# EAGLE design Lyra_Main_Solo (EAGLE 9.6.0)
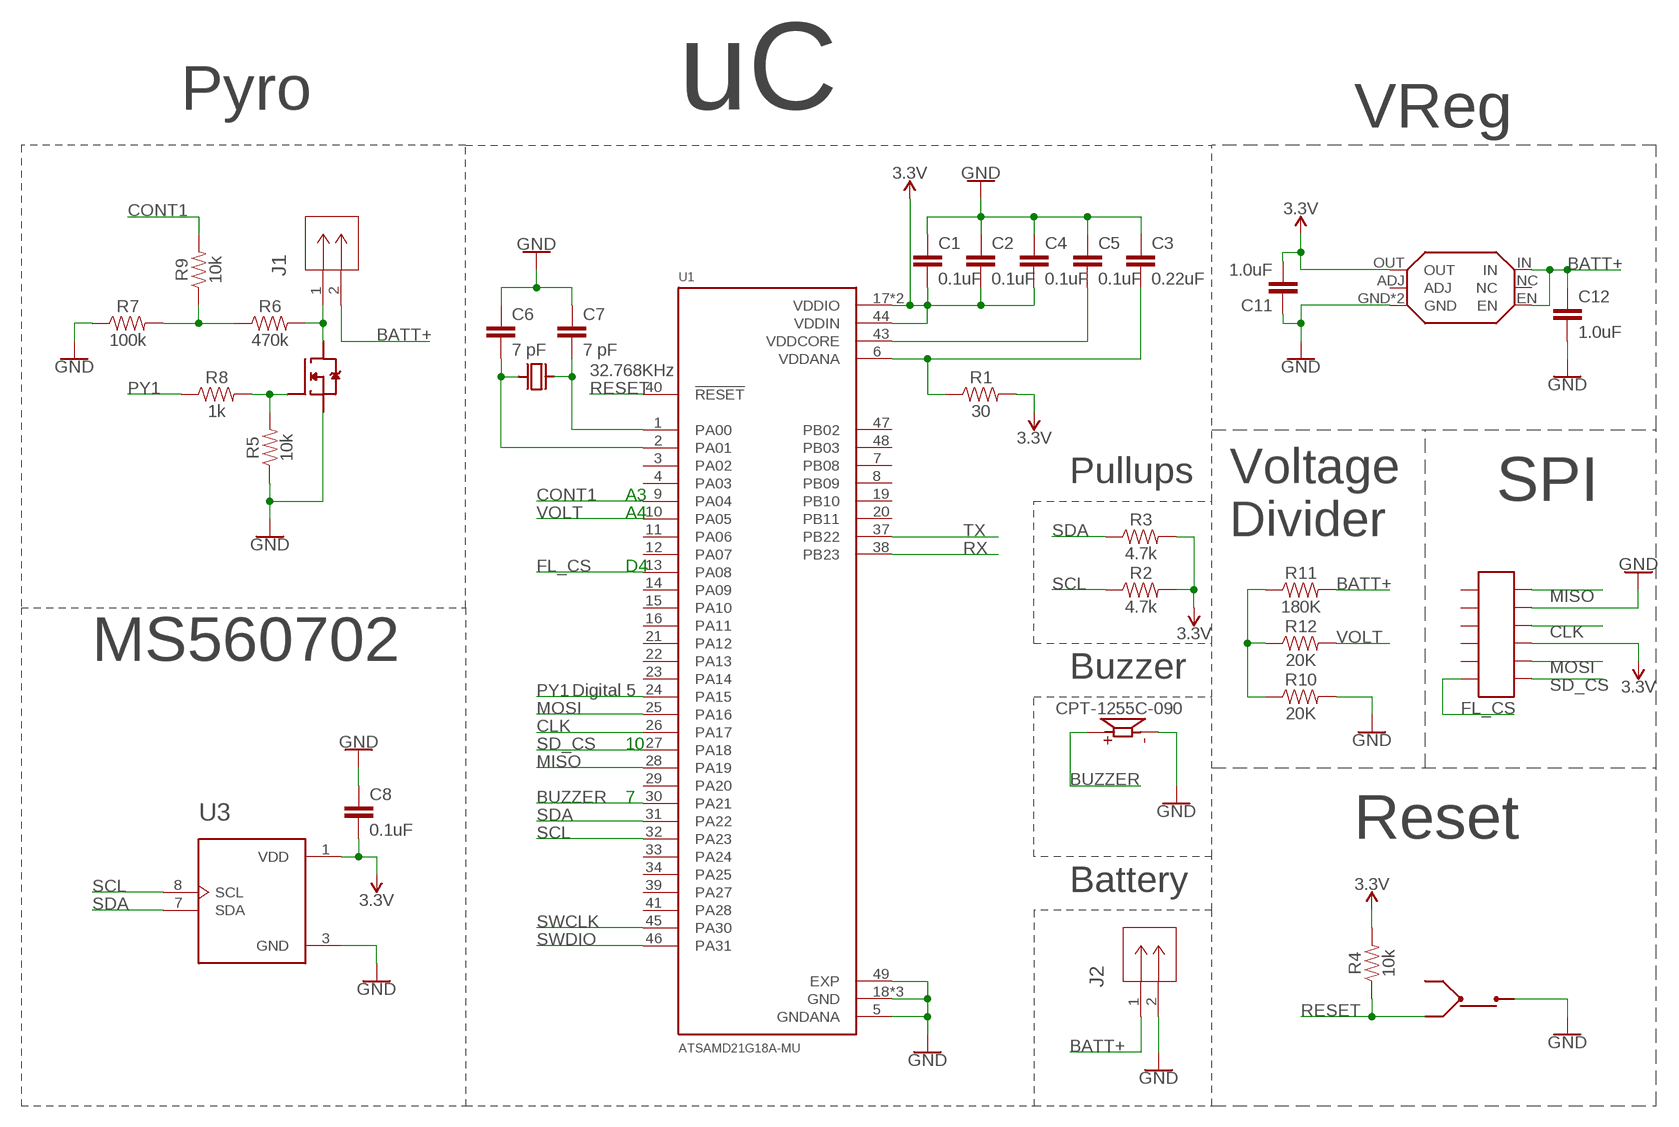
[diagram p0: schematic, sheet 1]

## Parts
C1  0.1uF  0.1UF-0603-25V-(+80/-20%)  [0603]
C2  0.1uF  0.1UF-0603-25V-(+80/-20%)  [0603]
C3  0.22uF  0.1UF-0603-25V-(+80/-20%)  [0603]
C4  0.1uF  0.1UF-0603-25V-(+80/-20%)  [0603]
C5  0.1uF  0.1UF-0603-25V-(+80/-20%)  [0603]
C6  7 pF  0.1UF-0402-16V-10%  [0402]
C7  7 pF  0.1UF-0402-16V-10%  [0402]
C8  0.1uF  0.1UF-0603-25V-(+80/-20%)  [0603]
C11  1.0uF  1.0UF-0402-16V-10%  [0402]
C12  1.0uF  1.0UF-0402-16V-10%  [0402]
J1  OSTVN02A150  [CONN_OSTVN02A150_OST]
J2  OSTVN02A150  [CONN_OSTVN02A150_OST]
LS2  CPT-1255C-090  [CUI_CPT-1255C-090]
R1  30  RESISTOR0402  [0402]
R2  4.7k  4.7KOHM-0603-1/10W-1%  [0603]
R3  4.7k  4.7KOHM-0603-1/10W-1%  [0603]
R4  10k  RESISTOR0402  [0402]
R5  10k  RESISTOR0402  [0402]
R6  470k  RESISTOR0402  [0402]
R7  100k  RESISTOR0402  [0402]
R8  1k  RESISTOR0402  [0402]
R9  10k  RESISTOR0402  [0402]
R10  20K  RESISTOR0402  [0402]
R11  180K  RESISTOR0402  [0402]
R12  20K  RESISTOR0402  [0402]
U1  ATSAMD21G18A-MU  [QFN50P700X700X90-49N]
U3  MS860702BA01-50  [TE_MS860702BA01-50]
U$1  32.768KHz  FC-135  [FC-135]
U$2  IRLHM630PBF  [IRLHM630PBF]
U$3  NCP718AMT330TBG  [NCP718BMT330TBG]
U$4  BUTTON  [BUTTON]
U$5  12POS_SOCKET  [12POS_SOCKET]

## Nets
3.3V: C1.2 C2.2 C4.2 C8.2 C11.2 R1.2 R2.2 R3.2 R4.2 U1.17(VDDIO) U1.36(VDDIO) U1.44(VDDIN) U3.1(VDD) U$3.OUT U$5.P$9
BATT+: C12.1 J1.2 J2.1 R11.2 U$3.EN U$3.IN
BUZZER: LS2.P U1.30(PA21)
CLK: U1.26(PA17) U$5.P$10
CONT1: R9.2 U1.9(PA04)
FL_CS: U1.13(PA08) U$5.P$6
GND: C1.1 C2.1 C3.1 C4.1 C5.1 C6.1 C7.1 C8.1 C11.1 C12.2 J2.2 LS2.N R5.1 R7.1 R10.2 U1.5(GNDANA) U1.18(GND) U1.35(GND) U1.42(GND) U1.49(EXP) U3.3(GND) U$2.P$2 U$2.P$3 U$2.P$4 U$3.GND U$3.P$7(GND) U$4.4(OUT) U$5.P$11
MISO [New Class]: U1.28(PA19) U$5.P$12
MOSI [New Class]: U1.25(PA16) U$5.P$8
N$1: C7.2 U1.1(PA00) U$1.P$2
N$2: J1.1 R6.2 U$2.P$5 U$2.P$6 U$2.P$7 U$2.P$8 U$2.P$9
N$3: R5.2 R8.2 U$2.P$1
N$4: C6.2 U1.2(PA01) U$1.P$1
N$5: R6.1 R7.2 R9.1
N$6: R10.1 R11.1 R12.1
N$8: C5.2 U1.43(VDDCORE)
N$9: C3.2 R1.1 U1.6(VDDANA)
PY1: R8.1 U1.24(PA15)
RESET: R4.1 U1.40(!RESET) U$4.2(IN(2))
RX: U1.38(PB23)
SCL: R2.1 U1.32(PA23) U3.8(SCL)
SD_CS [New Class]: U1.27(PA18) U$5.P$7
SDA: R3.1 U1.31(PA22) U3.7(SDA)
SWCLK: U1.45(PA30)
SWDIO: U1.46(PA31)
TX: U1.37(PB22)
VOLT: R12.2 U1.10(PA05)
Unconnected: U1.3(PA02) U1.4(PA03) U1.7(PB08) U1.8(PB09) U1.11(PA06) U1.12(PA07) U1.14(PA09) U1.15(PA10) U1.16(PA11) U1.19(PB10) U1.20(PB11) U1.21(PA12) U1.22(PA13) U1.23(PA14) U1.29(PA20) U1.33(PA24) U1.34(PA25) U1.39(PA27) U1.41(PA28) U1.47(PB02) U1.48(PB03) U$3.ADJ U$3.NC U$4.1(IN) U$5.P$1 U$5.P$2 U$5.P$3 U$5.P$4 U$5.P$5

## Notes on the sheet
- Pyro | uC | VReg
- Pullups
- A3 | SPI
- A4
- Voltage 
  Divider
- D4
- MS560702
- Buzzer
- Digital 5
- 10
- 7
- Reset
- Battery

## Library data of the parts
C1 C2 C4 C5 C8 = SparkFun-Capacitors:0.1UF: 0.1µF ceramic capacitors A capacitor is a passive two-terminal electrical component used to store electrical energy temporarily in an electric field.; PROD_ID: CAP-00810
C3 = SparkFun-Capacitors:0.1UF: 0.1µF ceramic capacitors A capacitor is a passive two-terminal electrical component used to store electrical energy temporarily in an electric field.; PROD_ID: CAP-00810; VALUE: 0.1uF
C6 C7 = SparkFun-Capacitors:0.1UF: 0.1µF ceramic capacitors A capacitor is a passive two-terminal electrical component used to store electrical energy temporarily in an electric field.; PROD_ID: CAP-12416; VALUE: 0.1uF
C11 C12 = SparkFun-Capacitors:1.0UF: 1µF ceramic capacitors A capacitor is a passive two-terminal electrical component used to store electrical energy temporarily in an electric field.; PROD_ID: CAP-12417
J1 J2 = 2pin2.54Terminal:OSTVN02A150; BUILT_BY: EMA_Cory; COPYRIGHT: Copyright (C) 2018 Accelerated Designs. All rights reserved; MANUFACTURER_PART_NUMBER: OSTVN02A150; SOURCELIBRARY: On_Shore_Technology_2019-12-02; VENDOR: On Shore Technology Inc
LS2 = CPT-1255C-090:CPT-1255C-090: Buzzer 12 mm, 20 Vp-p, 80 dB, Through Hole, Piezo Audio Transducer Buzzer Check prices <https://pricing.snapeda.com/parts/CPT-1255C-090/CUI%20Devices/view-part?ref=eda>; AVAILABILITY: Good; CUI_PURCHASE_URL: https://www.cuidevices.com/product/audio/buzzers/audio-transducers/cpt-1255c-090?utm_source=snapeda.com&utm_medium=referral&utm_campaign=snapedaBOM; DESCRIPTION: 12 mm, 20 Vp-p, 80 dB, Through Hole, Piezo Audio Transducer Buzzer; MF: CUI Devices; MP: CPT-1255C-090; PACKAGE: CUI Inc.; PRICE: None; PURCHASE-URL: https://pricing.snapeda.com/search/part/CPT-1255C-090/?ref=eda
R1 R4-R12 = SparkFun-Resistors:RESISTOR: Generic Resistor Package
R2 R3 = SparkFun-Resistors:4.7KOHM: 4.7kΩ resistor A resistor is a passive two-terminal electrical component that implements electrical resistance as a circuit element. Resistors act to reduce current flow, and, at the same time, act to lower voltage levels within circuits. - Wikipedia; PROD_ID: RES-07857
U1 = ATSAMD21G18A-MU:ATSAMD21G18A-MU: Cortex-M0+, 256KB FLASH, 32KB SRAM, USB, DMA, T&R - 48QFN IND TEMP, GREEN, 1.6-3.6V, 48MHz/ QFN (ZA); ARROW_ELECTRONICS-PURCHASE-URL: https://snapeda.com/shop?store=Arrow+Electronics&id=590181; DESCRIPTION: ARM® Cortex®-M0+ SAM D21G Microcontroller IC 32-Bit 48MHz 256KB (256K x 8) FLASH 48-QFN (7x7); DIGI-KEY_PART_NUMBER: ATSAMD21G18A-MUTTR-ND; DIGIKEY-PURCHASE-URL: https://snapeda.com/shop?store=DigiKey&id=590181; MF: Microchip; MOUSER-PURCHASE-URL: https://snapeda.com/shop?store=Mouser&id=590181; MP: ATSAMD21G18A-MU; PACKAGE: QFN-48 Microchip
U3 = MS860702BA01-50:MS860702BA01-50: Pressure Temp Humidity Sensor Buy Part <https://snapeda.com/parts/MS860702BA01-50/TE%20Connectivity/view-part/?ref=eda>; AVAILABILITY: Warning; COMMENT: MS860702BA01-50; DESCRIPTION: PHT SENSOR, 29PSI-10MBAR, QFN-8; EU_ROHS_COMPLIANCE: Compliant; MF: TE Connectivity; MOUSER-PURCHASE-URL: https://snapeda.com/shop?store=Mouser&id=555057; MP: MS860702BA01-50; PACKAGE: QFN-8 TE Connectivity; PRICE: None
U$1 = FC-135:FC-135
U$2 = irlhm630pbf:IRLHM630PBF
U$3 = NCP718AMT330TBG:NCP718AMT330TBG
U$4 = 4.2x3.2mm Momentary Pushbutton:BUTTON
U$5 = a4e-axe-connectors:12POS_SOCKET

## Board
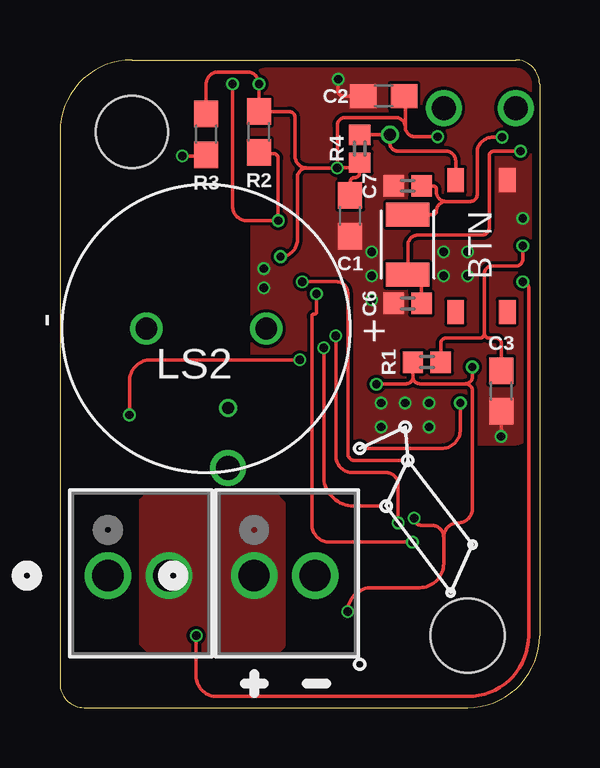
[diagram p1: board, top side]
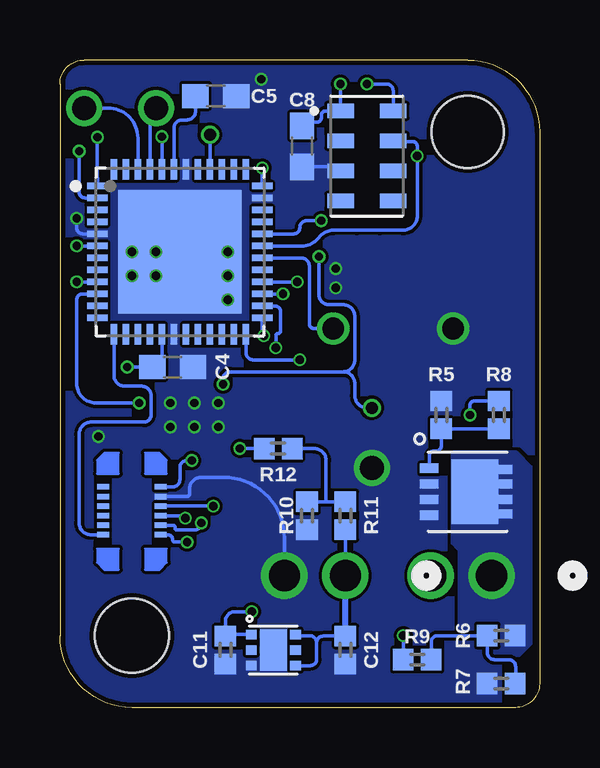
[diagram p2: board, bottom side, seen from below]

Size 20 x 27 mm. Coordinates in mm from the lower left corner, seen from the top.
Outline: 20,26 arc90 19,27 3,27 arc90 0,24 0,1 arc90 1,0 17,0 arc90 20,3 20,4.5 20,26
Copper layers (1*16): Top 0.035559375mm / dielectric 1.6mm / Bottom 0.035559375mm
Design rules "jlcpcb2layer *": minimum track width 5mil, minimum drill 12mil, track to track 5mil, track to pad 5mil, pad to pad 5mil, via to via 5mil, smd to smd 5mil, copper to edge 8mil, drill to drill 6mil, minimum pad ring 5mil, minimum via ring 3mil, stop-mask expansion 2.5mil, vias tented up to drill 15mil, thermal gap 10mil
Holes 3.1 mm at 17,3
Holes 3 mm at 3,24

### Footprints (pad centres in the part's own frame; a part is rotated, then mirrored left to right if it is on the bottom)
0603 = smd 1.1 x 1: 1 -0.85,0; 2 0.85,0
0402 = smd 0.85 x 0.9: 1 -0.58,0; 2 0.58,0
CONN_OSTVN02A150_OST = drill 1.295 pad 1.803: 1 0,0; 2 2.54,0
CUI_CPT-1255C-090 = drill 0.9: N 2.5,0; P -2.5,0
QFN50P700X700X90-49N = smd 0.84 x 0.26: 1 -3.435,2.75; 2 -3.435,2.25; 3 -3.435,1.75; 4 -3.435,1.25; 5 -3.435,0.75; 6 -3.435,0.25; 7 -3.435,-0.25; 8 -3.435,-0.75; 9 -3.435,-1.25; 10 -3.435,-1.75; 11 -3.435,-2.25; 12 -3.435,-2.75; 25 3.435,-2.75; 26 3.435,-2.25; 27 3.435,-1.75; 28 3.435,-1.25; 29 3.435,-0.75; 30 3.435,-0.25; 31 3.435,0.25; 32 3.435,0.75; 33 3.435,1.25; 34 3.435,1.75; 35 3.435,2.25; 36 3.435,2.75 | smd 0.26 x 0.84: 13 -2.75,-3.435; 14 -2.25,-3.435; 15 -1.75,-3.435; 16 -1.25,-3.435; 17 -0.75,-3.435; 18 -0.25,-3.435; 19 0.25,-3.435; 20 0.75,-3.435; 21 1.25,-3.435; 22 1.75,-3.435; 23 2.25,-3.435; 24 2.75,-3.435; 37 2.75,3.435; 38 2.25,3.435; 39 1.75,3.435; 40 1.25,3.435; 41 0.75,3.435; 42 0.25,3.435; 43 -0.25,3.435; 44 -0.75,3.435; 45 -1.25,3.435; 46 -1.75,3.435; 47 -2.25,3.435; 48 -2.75,3.435 | smd 5.15 x 5.15: 49 0,0
TE_MS860702BA01-50 = smd 1.1 x 0.6: 1 -1.1,1.875; 2 -1.1,0.625; 3 -1.1,-0.625; 4 -1.1,-1.875; 5 1.1,-1.875; 6 1.1,-0.625; 7 1.1,0.625; 8 1.1,1.875
FC-135 = smd 1 x 1.8: P$1 -1.25,0; P$2 1.25,0
IRLHM630PBF = smd 0.39 x 0.77: P$1 0.975,1.6; P$2 0.325,1.6; P$3 -0.325,1.6; P$4 -0.975,1.6 | smd 2.7 x 1.96: P$5 0,-0.3 | smd 0.39 x 0.58: P$6 -0.925,-1.57; P$7 -0.325,-1.57; P$8 0.325,-1.57; P$9 0.925,-1.57
NCP718BMT330TBG = smd 0.45 x 0.4: ADJ -0.925,0; EN 0.925,-0.65; GND -0.925,-0.65; IN 0.925,0.65; NC 0.925,0; OUT -0.925,0.65 | smd 1.12 x 1.72: P$7 0,0
BUTTON = smd 1 x 0.7: 1 0.5,2.5; 2 6,2.5; 3 0.5,0.35; 4 6,0.35
12POS_SOCKET = smd 0.5 x 0.23: P$1 -1.2,1.2; P$2 -1.2,0.8; P$3 -1.2,0.4; P$4 -1.2,0; P$5 -1.2,-0.4; P$6 -1.2,-0.8; P$7 1.2,-0.8; P$8 1.2,-0.4; P$9 1.2,0; P$10 1.2,0.4; P$11 1.2,0.8; P$12 1.2,1.2

### Placement (x,y rotation side)
C1  12.1,20.5 90 top
C2  13.5,25.5 0 top
C3  18.4,13.2 90 top
C4  15.3,14.2 180 bottom
C5  13.5,25.5 180 bottom
C6  14.5,16.85 0 top
C7  14.5,21.75 0 top
C8  9.9,23.4 90 bottom
C11  13.1,2.4 90 bottom
C12  8.1,2.4 270 bottom
J1  2,5.5 0 top
J2  8.1,5.5 0 top
LS2  6.1,15.8 180 top
R1  15.3,14.4 180 top
R2  8.3,24 90 top
R3  6.1,23.9 90 top
R4  12.5,23.3 270 top
R5  4.1,12.2 270 bottom
R6  1.6,3 0 bottom
R7  1.6,1 0 bottom
R8  1.7,12.2 270 bottom
R9  5.1,2 180 bottom
R10  9.7,8 270 bottom
R11  8.1,8 270 bottom
R12  10.9,10.8 180 bottom
U1  15,19 0 bottom
U3  7.2,23 0 bottom
U$1  14.5,19.3 90 top
U$2  3,9 90 bottom
U$3  11.1,2.4 0 bottom
U$4  19,16 90 top
U$5  17,8 0 bottom

### Tracks (layer width: path | path; a pad name or v marks a point on that pad's centre or on a via)
3.3V  (via drill 0.35, 0.5)
  Top 0.152: 16,7.1 16,6 arc-90 15,5 13,5 arc90 v12,4 | 16,7.1 arc-90 16.6,7.7 arc90 17.2,8.3 17.2,13.2 arc90 16.9,13.5 | 14.4,24.2 arc90 14.8,23.8 v15.75,23.8 | 14.4,24.2 14.4,25.45 arc90 C2.2 | v11.56,22.5 arc-90 11.59,22.52 12.4,22.52 12.5,22.62 R4.2 12.5,22.3 arc-90 12.3,22.1 arc90 12.1,21.9 C1.2 | 14.4,24.2 arc90 14,24.6 11.9,24.6 arc90 11.56,24.27 v11.56,22.5 | R3.2 6.1,26 arc-90 6.6,26.5 7.8,26.5 arc-90 v8.3,26 R2.2 9.55,24.85 arc-90 9.8,24.6 9.8,23 arc90 10.3,22.5 | 10.3,22.5 v11.56,22.5 | 10.3,22.5 arc90 9.9,22.1 9.9,19.5 arc-90 v9.2,18.8 | R1.2 14.72,13.78 | 14.72,13.78 arc90 15,13.5 16.9,13.5 | 16.9,13.5 arc90 17.2,13.8 v17.2,14.2 | 14.72,13.78 arc-90 14.44,13.5 13.22,13.5 arc90 v13.2,13.48 | 16,7.1 arc90 15.5,7.6 15.06,7.6 arc-90 v14.77,7.9
  Bottom 0.152: U1.17 15.75,14.66 arc82 C4.2 v17.2,14.2 | C8.2 arc-90 9.75,24.4 9.3,24.4 arc-90 9.1,24.6 9.1,24.7 arc90 8.93,24.88 U3.1 v8.3,26 | U1.44 v15.75,23.8 | U1.36 v11.56,22.5 | 8.2,14 arc-90 7.7,14.5 7.7,16.3 arc-90 8.2,16.8 8.8,16.8 arc90 9.2,17.2 v9.2,18.8 | 8.2,14 12.9,14 arc-90 13.2,13.7 v13.2,13.48 | C11.2 13.1,3 | 13.1,3 13.1,3.6 arc90 12.7,4 v12,4 | U$5.P$9 14.87,8 arc90 v14.77,7.9 | U$3.OUT 13.05,3.05 arc-90 13.1,3 | 8.2,14 arc90 7.7,13.5 7.7,13 arc-90 7.2,12.5 v7,12.5
BATT+
  Bottom 0.152: 8.17,3.05 C12.1 9.02,2.98 arc-90 9.3,2.7 | R11.2 J2.1 | U$3.EN 9.55,1.75 arc-90 9.3,2 9.3,2.7 | 9.3,2.7 arc-90 9.6,3 10.12,3 arc90 U$3.IN
  Bottom 0.254: C12.1 J2.1
  pour Top (no thermals): 3.4,8.6 3.4,2.7 3.9,2.2 8.9,2.2 9.3,2.6 9.3,8.5 8.9,8.9 3.7,8.9
BUZZER
  Bottom 0.152: LS2.P 9.4,15.8 arc90 9.6,16 9.6,18.4 arc-90 9.95,18.75 U1.30
CLK  (via drill 0.35)
  Top 0.152: v11,15 11,9.68 arc91 12.25,8.4 v13.6,8.4
  Bottom 0.152: v11,15 11,15.5 arc90 10.9,15.6 arc-90 10.8,15.7 10.8,16.5 arc-90 11.05,16.75 U1.26 | v13.6,8.4 U$5.P$10
CONT1  (via drill 0.35)
  Top 0.152: v19.3,17.75 arc-90 19.54,17.51 19.54,3 arc-90 17,0.46 6.54,0.46 arc-90 5.68,1.3 v5.68,3
  Bottom 0.152: U1.9 v19.3,17.75 | R9.2 v5.68,3
FL_CS
  Bottom 0.152: U1.13 17.75,13.85 arc-90 17.3,13.4 16.6,13.4 arc90 16.2,13 16.2,12.2 arc90 16.5,11.9 18.7,11.9 arc-90 19.2,11.4 19.2,7.7 arc-90 18.7,7.2 U$5.P$6
GND  (via drill 0.35, 1)
  Top 0.152: C5.1 11.8,25.5 arc-90 11.6,25.7 v11.6,26.2 | C3.1 v18.4,11.3
  Bottom 0.152: U1.49 v16,18 | U1.5 19.05,19.75 arc90 19.3,20 v19.3,20.4 | U3.3 arc-90 8.47,22.55 | U3.3 arc-90 8.47,22.55 | U3.3 arc-90 8.47,22.55 | 8.47,22.55 C8.1 | U$5.P$11 14.7,8.8 arc-90 14.6,8.9 14.6,9.1 arc90 14.1,9.6 13.18,9.6 arc90 10.64,7.06 J2.2
  other vias: 7,10 13,17 13,18 13,19 16,19 17,19 17,18 13.4,11.7 14.4,12.7 14.4,11.7 15.4,12.7 15.4,11.7 8.5,18.3 8.5,17.5 13.4,12.7
  pour Bottom (rank 2, no thermals): 1,0 17,0 arc90 20,3 20,27 3,27 arc90 0,24 0,1 arc90
  pour Top (no thermals): 19,11 8.4,11 arc-90 8,11.4 8,26 arc-90 8.61,26.61 18.98,26.61 arc-90 19.62,25.97 19.62,11.62 arc-90
MISO  (via drill 0.35)
  Top 0.152: v10.1,17.75 11.55,17.75 arc-90 12,17.3 12,10.6 arc90 12.3,10.3 v14.5,10.3
  Bottom 0.152: U1.28 v10.11,17.75 arc32 v10.1,17.75 | v14.5,10.3 14.7,10.3 arc-90 15,10 15,9.5 arc90 15.3,9.2 U$5.P$12
MOSI  (via drill 0.35)
  Top 0.152: v11.5,15.5 11.5,10.5 arc90 12.2,9.8 13.6,9.8 arc-90 14.1,9.3 v14.1,7.7
  Bottom 0.152: U1.25 11.56,15.56 arc-90 v11.5,15.5 | U$5.P$8 15.3,7.6 arc90 15.2,7.5 arc-90 15.1,7.4 14.4,7.4 arc-90 v14.1,7.7
N$1  (via drill 0.35)
  Top 0.152: v18.44,23.78 18.05,23.78 arc93 17.4,23.09 17.4,21.4 arc-90 17.1,21.1 16.1,21.1 | C7.2 15.55,21.75 arc-90 15.7,21.6 15.7,21.5 arc90 16.1,21.1 | U$1.P$2 15.55,20.55 arc90 15.7,20.7 arc-90 16.1,21.1
  Bottom 0.152: U1.1 18.44,22.47 arc1 v18.44,23.78
N$2
  pour Bottom (no thermals): 3.3,6.6 3.3,2.6 2.9,2.2 0.9,2.2 0.4,2.7 0.4,10 1,10.6 3.6,10.6 3.6,6.9
N$3
  Bottom 0.152: R8.2 R5.2 4.1,10.9 arc90 4.3,10.7 4.4,10.7 arc-90 4.6,10.5 U$2.P$1
N$4  (via drill 0.35)
  Top 0.152: v19.2,23.2 18.1,23.2 arc90 17.9,23 17.9,20 arc-90 17.6,19.7 14.94,19.7 arc90 14.5,19.26 U$1.P$1 arc90 14.55,18 15,18 arc-90 15.08,17.92 C6.2
  Bottom 0.152: U1.2 18.96,21.25 arc92 19.2,21.5 v19.2,23.2
N$5
  Bottom 0.152: R7.2 1,1.02 1,1.71 arc-45 1.09,1.92 arc-45 1.29,2 1.88,2 arc45 2.09,2.09 2.09,2.09 arc45 2.18,2.3 R6.1 4,3 4.25,3 arc-90 4.52,2.73 R9.1
N$6
  Bottom 0.152: R11.1 8.9,8.58 | 8.9,8.58 R10.1 | 8.9,8.58 8.9,10.3 arc-90 9.4,10.8 R12.1
N$8
  Bottom 0.152: U1.43 15.25,24.15 arc90 14.9,24.5 14.7,24.5 arc-90 14.35,24.85 C5.2
N$9  (via drill 0.35)
  Top 0.152: R1.1 15.88,15.18 arc-90 16.1,15.4 17.5,15.4 arc90 17.7,15.6 | 17.7,15.6 arc90 17.9,15.4 18.2,15.4 arc-90 18.4,15.2 C3.2 | v19.3,19.25 19.3,18.7 arc-90 19,18.4 18,18.4 arc90 17.7,18.1 17.7,15.6
  Bottom 0.152: U1.6 v19.3,19.25
PY1  (via drill 0.35)
  Top 0.152: v10,14.5 3.8,14.5 arc90 2.9,13.6 v2.9,12.2
  Bottom 0.152: R8.1 2.72,12.78 arc-90 2.9,12.6 v2.9,12.2 | U1.24 12.25,14.81 arc-97 11.9,14.5 v10,14.5
RESET  (via drill 0.5)
  Top 0.152: U$4.2 16.5,22.8 arc90 16.1,23.2 14.1,23.2 arc-90 13.75,23.55 v13.75,23.89 R4.1
  Bottom 0.152: U1.40 v13.75,23.89
SCL  (via drill 0.35)
  Top 0.152: v7.2,26 7.2,20.9 arc90 7.8,20.3 v9.1,20.3 9.1,22.9 arc90 8.9,23.1 8.35,23.1 arc-90 R2.1
  Bottom 0.152: U3.8 6.1,25.7 arc-90 6.4,26 v7.2,26 | U1.32 10.25,19.75 arc-90 10,20 arc90 9.7,20.3 v9.1,20.3
SD_CS  (via drill 0.35)
  Top 0.152: v10.7,17.25 10.7,16.5 arc-90 10.6,16.4 arc90 10.5,16.3 10.5,7.64 arc90 11.24,6.9 v14.7,6.9
  Bottom 0.152: v10.7,17.25 U1.27 | v14.7,6.9 15.2,6.9 arc90 15.3,7 arc-90 15.5,7.2 U$5.P$7
SDA  (via drill 0.35)
  Top 0.152: 6.05,23 arc90 R3.1 arc-90 6.05,23 | 6.05,23 v5.1,23
  Bottom 0.152: U1.31 11.46,19.25 11.46,19.24 9.9,19.24 arc-51 9.2,19.6 arc52 8.6,19.9 arc1 5.7,19.9 arc-91 5.1,20.5 arc1 5.1,20.7 arc-1 5.1,21.2 v5.1,23 5.1,23.4 arc-90 5.3,23.6 6.08,23.6 arc90 U3.7
SWCLK  (via drill 1)
  Bottom 0.152: U1.45 16.25,24.75 arc33 v16,25
SWDIO  (via drill 1)
  Bottom 0.152: U1.46 16.75,23.75 arc-90 18,25 v19,25
VOLT  (via drill 0.35)
  Top 0.152: v16.7,12.7 16.7,11.6 arc-90 15.9,10.8 v12.5,10.8
  Bottom 0.152: U1.10 19.05,17.25 arc-90 19.3,17 19.3,13.5 arc-90 18.5,12.7 v16.7,12.7 | R12.2 v12.5,10.8